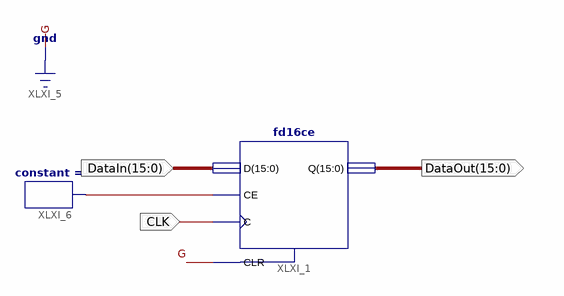
[diagram p0: schematic sheet 1]
// Xilinx ISE schematic Memory_Data_Register.sch (spartan3e) as structural Verilog: 2 symbols, 3 ports
module Memory_Data_Register (
  input  [15:0] DataIn,
  input  CLK,
  output [15:0] DataOut
);

  wire XLXN_7;

  fd16ce XLXI_1 (.C(CLK), .CE(XLXN_7), .CLR(1'b0), .D(DataIn), .Q(DataOut));
  constant #(.CValue("1")) XLXI_6 (.O(XLXN_7));
endmodule
